# EAGLE schematic dropper_torpedo (EAGLE 9.5.2)
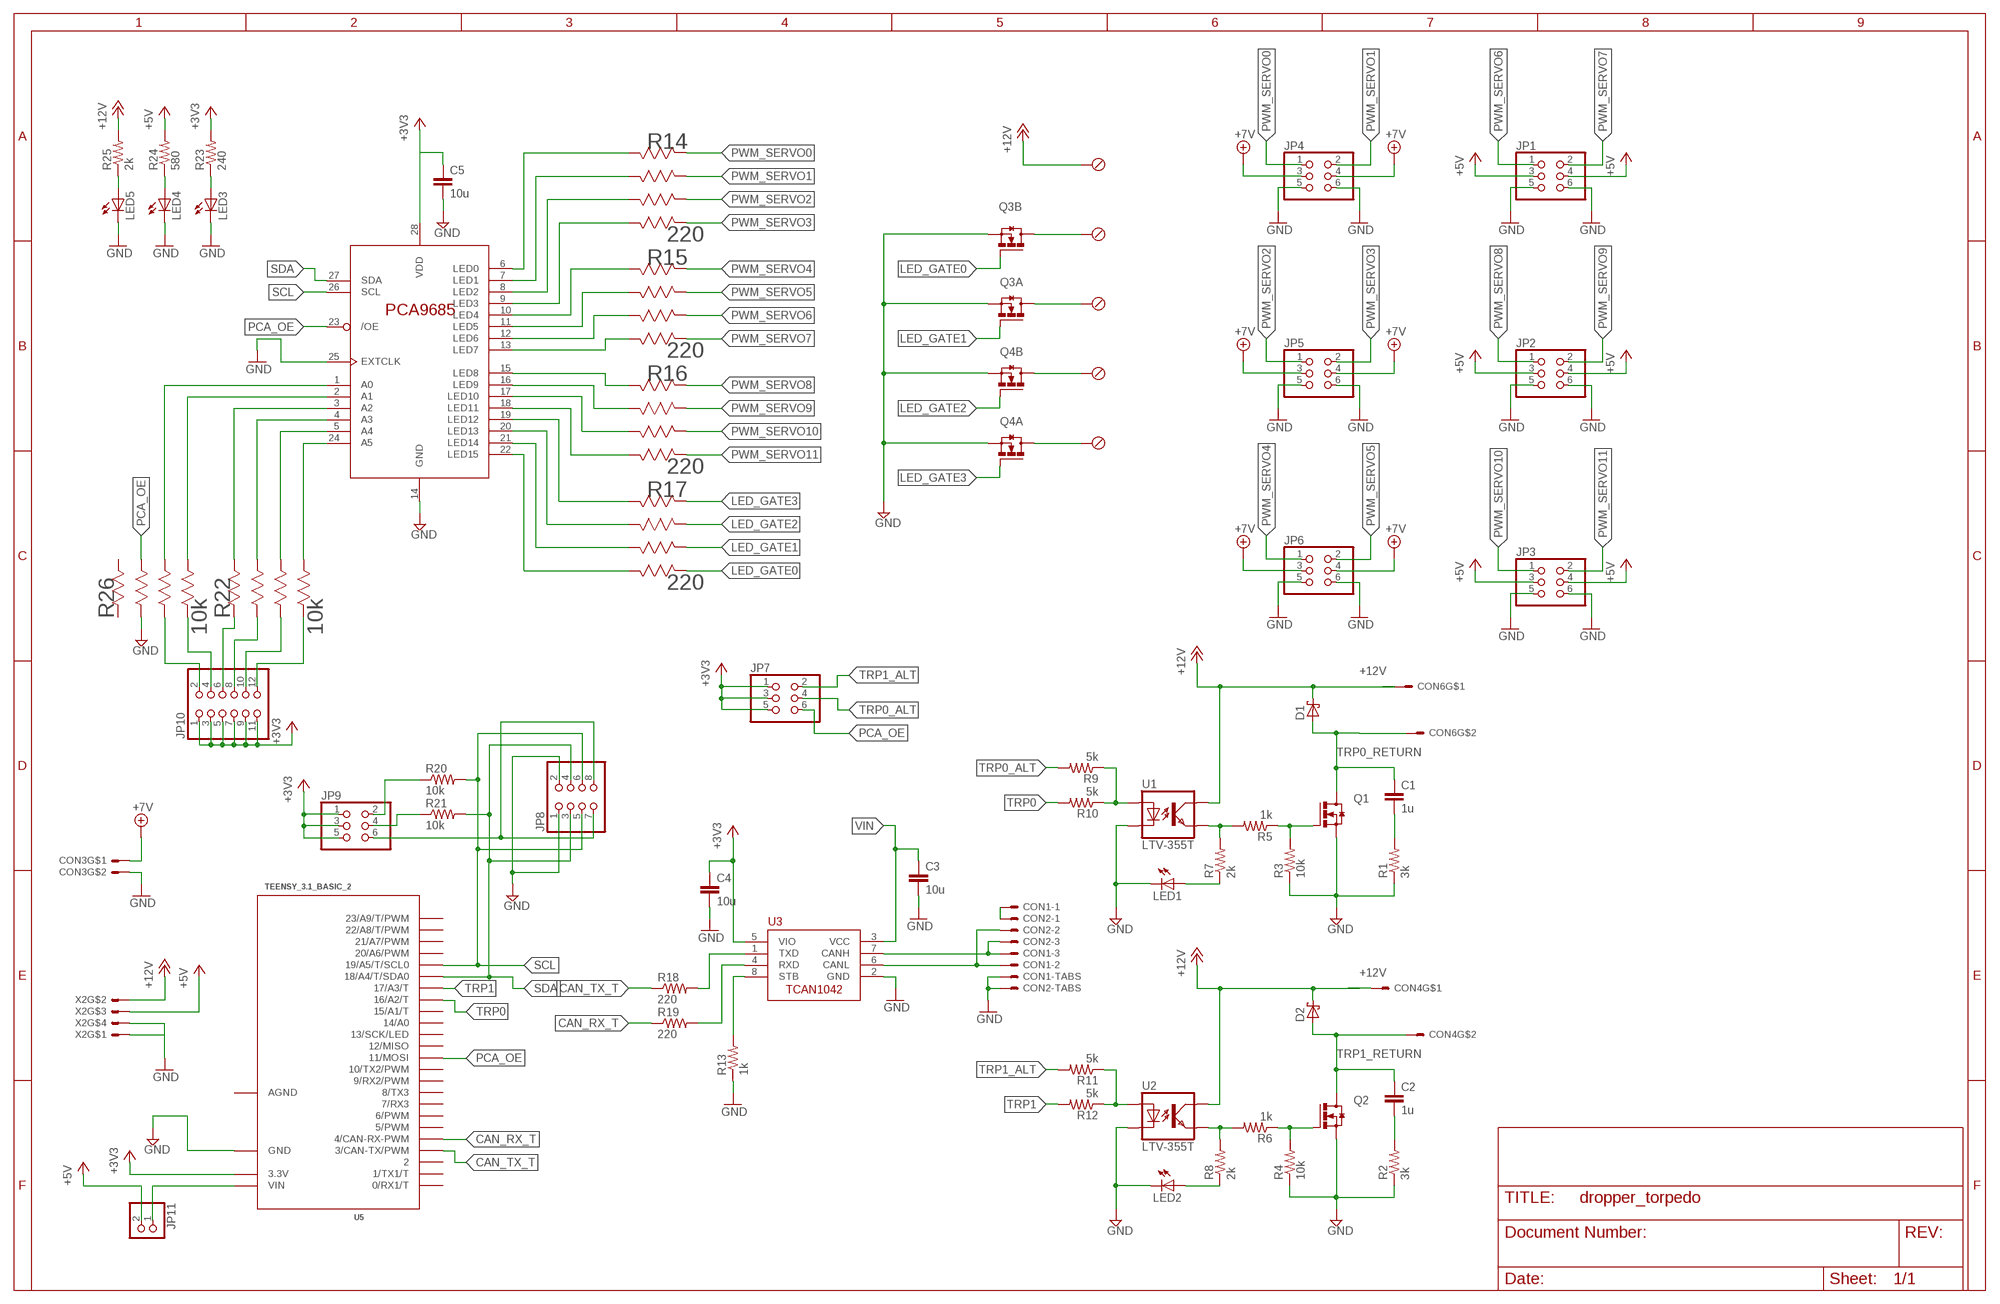
[diagram p0: schematic, sheet 1]

## Parts
C1  1u  C-EUC1206  [C1206]
C2  1u  C-EUC1206  [C1206]
C3  10u  C-EUC0805  [C0805]
C4  10u  C-EUC0805  [C0805]
C5  10u  C-EUC0805  [C0805]
CON1  SM03B-GHS-TB  [SM03B-GHS-TB]
CON2  SM03B-GHS-TB  [SM03B-GHS-TB]
CON3  MOLEX_5566-2  [5566-2]
CON4  MOLEX_5566-2  [5566-2]
CON6  MOLEX_5566-2  [5566-2]
D1  STPS1L30A  [DO214AC]
D2  STPS1L30A  [DO214AC]
JP1  PINHD-2X3  [2X03]
JP2  PINHD-2X3  [2X03]
JP3  PINHD-2X3  [2X03]
JP4  PINHD-2X3  [2X03]
JP5  PINHD-2X3  [2X03]
JP6  PINHD-2X3  [2X03]
JP7  PINHD-2X3  [2X03]
JP8  PINHD-2X4  [2X04]
JP9  PINHD-2X3  [2X03]
JP10  PINHD-2X6  [2X06]
JP11  PINHD-1X2  [1X02]
LED1  LEDCHIPLED_1206  [CHIPLED_1206]
LED2  LEDCHIPLED_1206  [CHIPLED_1206]
LED3  LEDCHIPLED_1206  [CHIPLED_1206]
LED4  LEDCHIPLED_1206  [CHIPLED_1206]
LED5  LEDCHIPLED_1206  [CHIPLED_1206]
Q1  SI4896DY-T1-E3  [SO-8]
Q2  SI4896DY-T1-E3  [SO-8]
Q3  IRL6372TRPBF  [SO-8]
Q4  IRL6372TRPBF  [SO-8]
R1  3k  R-US_R1206  [R1206]
R2  3k  R-US_R1206  [R1206]
R3  10k  R-US_R1206  [R1206]
R4  10k  R-US_R1206  [R1206]
R5  1k  R-US_R1206  [R1206]
R6  1k  R-US_R1206  [R1206]
R7  2k  R-US_R1206  [R1206]
R8  2k  R-US_R1206  [R1206]
R9  5k  R-US_R0805  [R0805]
R10  5k  R-US_R0805  [R0805]
R11  5k  R-US_R0805  [R0805]
R12  5k  R-US_R0805  [R0805]
R13  1k  R-US_R0805  [R0805]
R14  220  EXB-V8V221JVEXBV8V-M  [EXBV8V-M]
R15  220  EXB-V8V221JVEXBV8V-M  [EXBV8V-M]
R16  220  EXB-V8V221JVEXBV8V-M  [EXBV8V-M]
R17  220  EXB-V8V221JVEXBV8V-M  [EXBV8V-M]
R18  220  R-US_R0805  [R0805]
R19  220  R-US_R0805  [R0805]
R20  10k  R-US_R1206  [R1206]
R21  10k  R-US_R1206  [R1206]
R22  10k  EXB-V8V221JVEXBV8V-M  [EXBV8V-M]
R23  240  R-US_R1206  [R1206]
R24  580  R-US_R1206  [R1206]
R25  2k  R-US_R1206  [R1206]
R26  10k  EXB-V8V221JVEXBV8V-M  [EXBV8V-M]
U1  LTV-355T  [SMD4]
U2  LTV-355T  [SMD4]
U3  TCAN1042HVDR  [SO-8]
U4  PCA9685PW  [TSSOP28]
U5  TEENSY_3.1_BASIC_2  [TEENSY_3.1_BASIC_2]
X1  OSTVN05A150  [OSTVN05A150]
X2  MOLEX_5566-4  [5566-4]

## Nets
+3V3: C4.1 C5.1 JP7.1 JP7.3 JP7.5 JP9.1 JP9.3 JP9.5 JP10.1 JP10.3 JP10.5 JP10.7 JP10.9 JP10.11 R23.2 U3.5(VIO) U4.28(VDD) U5.3.3V
+5V: JP1.3 JP1.4 JP2.3 JP2.4 JP3.3 JP3.4 JP11.2 R24.2 X2.3
+7V: CON3.1 JP4.3 JP4.4 JP5.3 JP5.4 JP6.3 JP6.4
+12V: CON4.1 CON6.1 D1.C D2.C R25.2 U1.COLLECTOR(COL) U2.COLLECTOR(COL) X1.P$5 X2.2
A0: R26.6 U4.1(A0)
A0+: JP10.2 R26.3
A1: R26.5 U4.2(A1)
A1+: JP10.4 R26.4
A2: R22.8 U4.3(A2)
A2+: JP10.6 R22.1
A3: R22.7 U4.4(A3)
A3+: JP10.8 R22.2
A4: R22.6 U4.5(A4)
A4+: JP10.10 R22.3
A5: R22.5 U4.24(A5)
A5+: JP10.12 R22.4
CAN_RX: R19.2 U3.4(RXD)
CAN_RX_T: R19.1 U5.4(4/CAN-RX-PWM)
CAN_TX1: R18.2 U3.1(TXD)
CAN_TX_T: R18.1 U5.3(3/CAN-TX/PWM)
CANH: CON1.P$3 CON2.P$3 U3.7(CANH)
CANL: CON1.P$2 CON2.P$2 U3.6(CANL)
CANSH: CON1.P$1 CON2.P$1
GND [net1]: C3.2 C4.2 C5.2 CON1.P$4 CON1.P$5 CON2.P$4 CON2.P$5 CON3.2 JP1.5 JP1.6 JP2.5 JP2.6 JP3.5 JP3.6 JP4.5 JP4.6 JP5.5 JP5.6 JP6.5 JP6.6 JP8.1 JP8.2 LED1.C LED2.C LED3.C LED4.C LED5.C Q1.1(S) Q1.2(S) Q1.3(S) Q2.1(S) Q2.2(S) Q2.3(S) Q3.1(B:S) Q3.3(A:S) Q4.1(B:S) Q4.3(A:S) R1.1 R2.1 R3.1 R4.1 R13.1 R26.2 U1.CATHODE(C) U2.CATHODE(C) U3.2(GND) U4.14(GND) U4.25(EXTCLK) U5.GND X2.1 X2.4
I2C_3V3: JP8.7 JP8.8 JP9.6
LED_DRAIN0: Q3.7(B:D) Q3.8(B:D) X1.P$4
LED_DRAIN1: Q3.5(A:D) Q3.6(A:D) X1.P$3
LED_DRAIN2: Q4.7(B:D) Q4.8(B:D) X1.P$2
LED_DRAIN3: Q4.5(A:D) Q4.6(A:D) X1.P$1
LED_GATE0: Q3.2(B:G) R17.4
LED_GATE1: Q3.4(A:G) R17.3
LED_GATE2: Q4.2(B:G) R17.2
LED_GATE3: Q4.4(A:G) R17.1
N$1: LED1.A R7.1
N$2: LED2.A R8.1
N$3: LED3.A R23.1
N$4: LED4.A R24.1
N$5: LED5.A R25.1
PCA_OE: JP7.6 R26.7 U4.23(/OE) U5.11(11/MOSI)
PWM_CH0: R14.8 U4.6(LED0)
PWM_CH1: R14.7 U4.7(LED1)
PWM_CH2: R14.6 U4.8(LED2)
PWM_CH3: R14.5 U4.9(LED3)
PWM_CH4: R15.8 U4.10(LED4)
PWM_CH5: R15.7 U4.11(LED5)
PWM_CH6: R15.6 U4.12(LED6)
PWM_CH7: R15.5 U4.13(LED7)
PWM_CH8: R16.8 U4.15(LED8)
PWM_CH9: R16.7 U4.16(LED9)
PWM_CH10: R16.6 U4.17(LED10)
PWM_CH11: R16.5 U4.18(LED11)
PWM_CH12: R17.8 U4.19(LED12)
PWM_CH13: R17.7 U4.20(LED13)
PWM_CH14: R17.6 U4.21(LED14)
PWM_CH15: R17.5 U4.22(LED15)
PWM_SERVO0: JP4.1 R14.1
PWM_SERVO1: JP4.2 R14.2
PWM_SERVO2: JP5.1 R14.3
PWM_SERVO3: JP5.2 R14.4
PWM_SERVO4: JP6.1 R15.1
PWM_SERVO5: JP6.2 R15.2
PWM_SERVO6: JP1.1 R15.3
PWM_SERVO7: JP1.2 R15.4
PWM_SERVO8: JP2.1 R16.1
PWM_SERVO9: JP2.2 R16.2
PWM_SERVO10: JP3.1 R16.3
PWM_SERVO11: JP3.2 R16.4
RC0: C1.2 R1.2
RC1: C2.2 R2.2
SCL: JP8.5 JP8.6 R20.2 U4.26(SCL) U5.19/A5(19/A5/T/SCL0)
SCL_3V3: JP9.2 R20.1
SDA: JP8.3 JP8.4 R21.2 U4.27(SDA) U5.18/A4(18/A4/T/SDA0)
SDA_3V3: JP9.4 R21.1
STB: R13.2 U3.8(STB)
TOPTO_A0: R9.1 R10.1 U1.ANODE(A)
TOPTO_A1: R11.1 R12.1 U2.ANODE(A)
TOPTO_E0: R5.2 R7.2 U1.EMITTER(EMIT)
TOPTO_E1: R6.2 R8.2 U2.EMITTER(EMIT)
TRP0: R10.2 U5.16/A2(16/A2/T)
TRP0_ALT: JP7.4 R9.2
TRP0_RETURN: CON6.2
TRP1: R12.2 U5.17/A3(17/A3/T)
TRP1_ALT: JP7.2 R11.2
TRP1_RETURN: C2.1 CON4.2 D2.A Q2.5(D) Q2.6(D) Q2.7(D) Q2.8(D)
TRP_GATE0: Q1.4(G) R3.2 R5.1
TRP_GATE1: Q2.4(G) R4.2 R6.1
TRP_RETURN0: C1.1 D1.A Q1.5(D) Q1.6(D) Q1.7(D) Q1.8(D)
VIN: C3.1 JP11.1 U3.3(VCC) U5.VIN
Unconnected: R26.1 R26.8 U5.0(0/RX1/T) U5.1(1/TX1/T) U5.2 U5.5(5/PWM) U5.6(6/PWM) U5.7(7/RX3) U5.8(8/TX3) U5.9(9/RX2/PWM) U5.10(10/TX2/PWM) U5.12(12/MISO) U5.13(13/SCK/LED) U5.14/A0 U5.15/A1(15/A1/T) U5.20/A6(20/A6/PWM) U5.21/A7(21/A7/PWM) U5.22/A8(22/A8/T/PWM) U5.23/A9(23/A9/T/PWM)

## Power pins joined to a net without a drawn wire
AGND: U5.AGND

## Library data of the parts
C1-C5 = rcl:C-EU: CAPACITOR, European symbol
CON1 CON2 = ARVP:SM03B-GHS-TB
CON3 CON4 CON6 = ARVP:MOLEX_5566-2
D1 D2 = dropper_torpedo_v3:STPS1L30A
JP1-JP7 JP9 = pinhead:PINHD-2X3: PIN HEADER
JP8 = pinhead:PINHD-2X4: PIN HEADER
JP10 = pinhead:PINHD-2X6: PIN HEADER
JP11 = pinhead:PINHD-1X2: PIN HEADER
LED1-LED5 = led:LED: LED OSRAM: - CHIPLED LG R971, LG N971, LY N971, LG Q971, LY Q971, LO R971, LY R971 LH N974, LH R974 LS Q976, LO Q976, LY Q976 LO Q996 - Hyper CHIPLED LW Q18S LB Q993, LB Q99A, LB R99A - SideLED LS A670, LO A670, LY A670, LG A670, LP A670 LB A673, LV A673, LT A673, LW A673 LH A674 LY A675 LS A676, LA A676, LO A676, LY A676, LW A676 LS A679, LY A679, LG A679 - Hyper Micro SIDELED® LS Y876, LA Y876, LO Y876, LY Y876 LT Y87S - SmartLED LW L88C, LW L88S LB L89C, LB L89S, LG L890 LS L89K, LO L89K, LY L89K LS L896, LA L896, LO L896, LY L896 - TOPLED LS T670, LO T670, LY T670, LG T670, LP T670 LSG T670, LSP T670, LSY T670, LOP T670, LYG T670 LG T671, LOG T671, LSG T671 LB T673, LV T673, LT T673, LW T673 LH T674 LS T676, LA T676, LO T676, LY T676, LB T676, LH T676, LSB T676, LW T676 LB T67C, LV T67C, LT T67C, LS T67K, LO T67K, LY T67K, LW E67C LS E67B, LA E67B, LO E67B, LY E67B, LB E67C, LV E67C, LT E67C LW T67C LS T679, LY T679, LG T679 LS T770, LO T770, LY T770, LG T770, LP T770 LB T773, LV T773, LT T773, LW T773 LH T774 LS E675, LA E675, LY E675, LS T675 LS T776, LA T776, LO T776, LY T776, LB T776 LHGB T686 LT T68C, LB T68C - Hyper Mini TOPLED® LB M676 - Mini TOPLED Santana® LG M470 LS M47K, LO M47K, LY M47K Source: http://www.osram.convergy.de LUXEON: - LUMILED® LXK2-PW12-R00, LXK2-PW12-S00, LXK2-PW14-U00, LXK2-PW14-V00 LXK2-PM12-R00, LXK2-PM12-S00, LXK2-PM14-U00 LXK2-PE12-Q00, LXK2-PE12-R00, LXK2-PE12-S00, LXK2-PE14-T00, LXK2-PE14-U00 LXK2-PB12-K00, LXK2-PB12-L00, LXK2-PB12-M00, LXK2-PB14-N00, LXK2-PB14-P00, LXK2-PB14-Q00 LXK2-PR12-L00, LXK2-PR12-M00, LXK2-PR14-Q00, LXK2-PR14-R00 LXK2-PD12-Q00, LXK2-PD12-R00, LXK2-PD12-S00 LXK2-PH12-R00, LXK2-PH12-S00 LXK2-PL12-P00, LXK2-PL12-Q00, LXK2-PL12-R00 Source: www.luxeon.com KINGBRIGHT: KA-3528ASYC Source: www.kingbright.com
Q1 Q2 = dropper_torpedo_v3:SI4896DY-T1-E3
Q3 Q4 = dropper_torpedo_v3:IRL6372TRPBF
R1-R13 R18-R21 R23-R25 = rcl:R-US_: RESISTOR, American symbol
R14-R17 R22 R26 = ARVP:EXB-V8V221JV; MANUFACTURER_PART_NUMBER: EXBV8V221JV; VENDOR: Panasonic
U1 U2 = dropper_torpedo_v3:LTV-355T
U3 = ARVP:TCAN1042HVDR
U4 = dropper_torpedo_v3:PCA9685
U5 = Teensy_3_Series_Board_v1.0:TEENSY_3.1_BASIC_2: Footprint for Teensy 3.1 board using all pin connections on the outer perimeter
X1 = dropper_torpedo_v3:OSTVN05A150
X2 = ARVP:MOLEX_5566-4

## Net classes
1 net1: clearance 0.203 mm to class 0